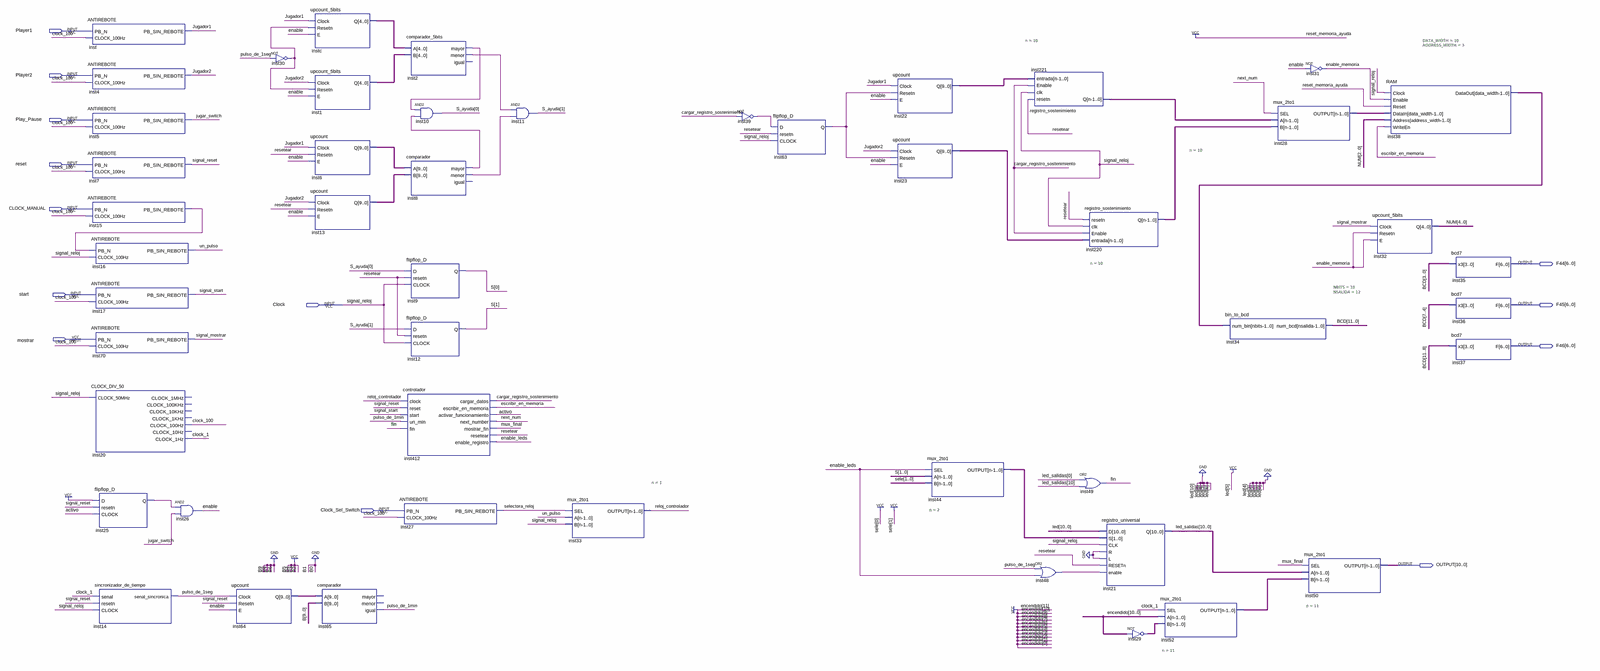
[diagram p0: schematic sheet, whole]
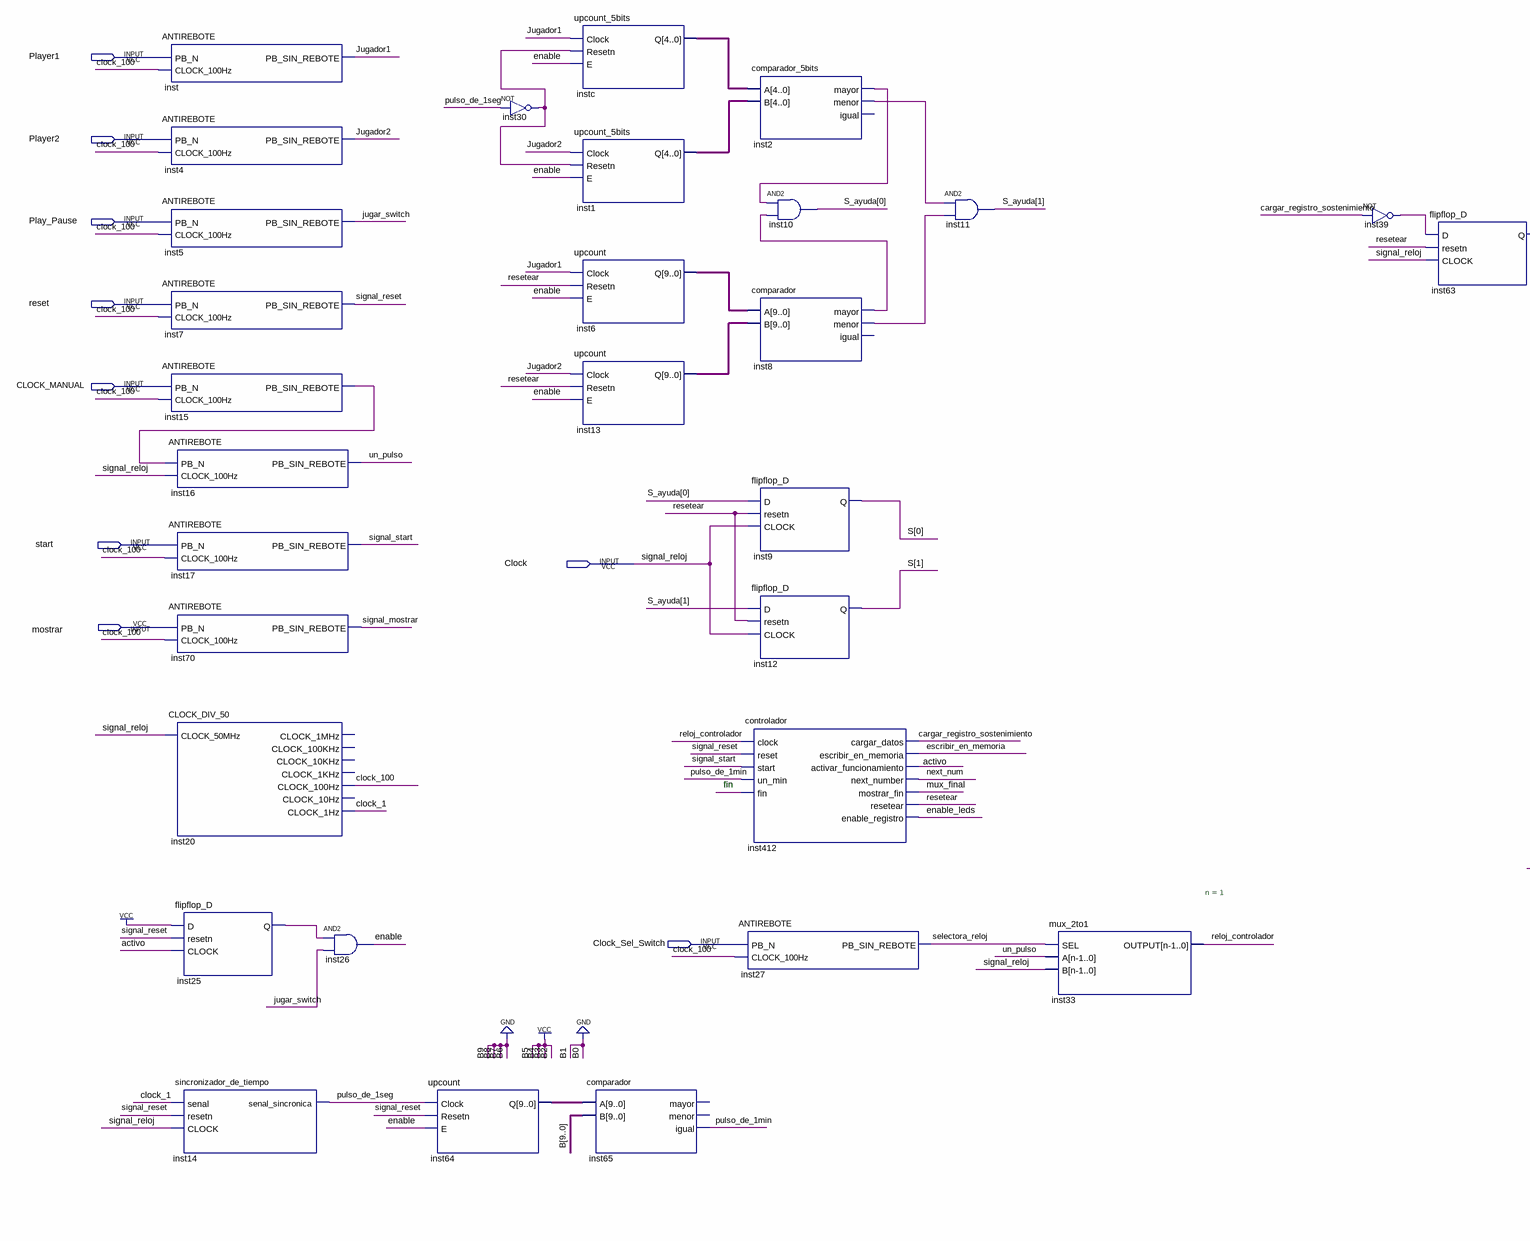
[diagram p1: schematic sheet, left part]
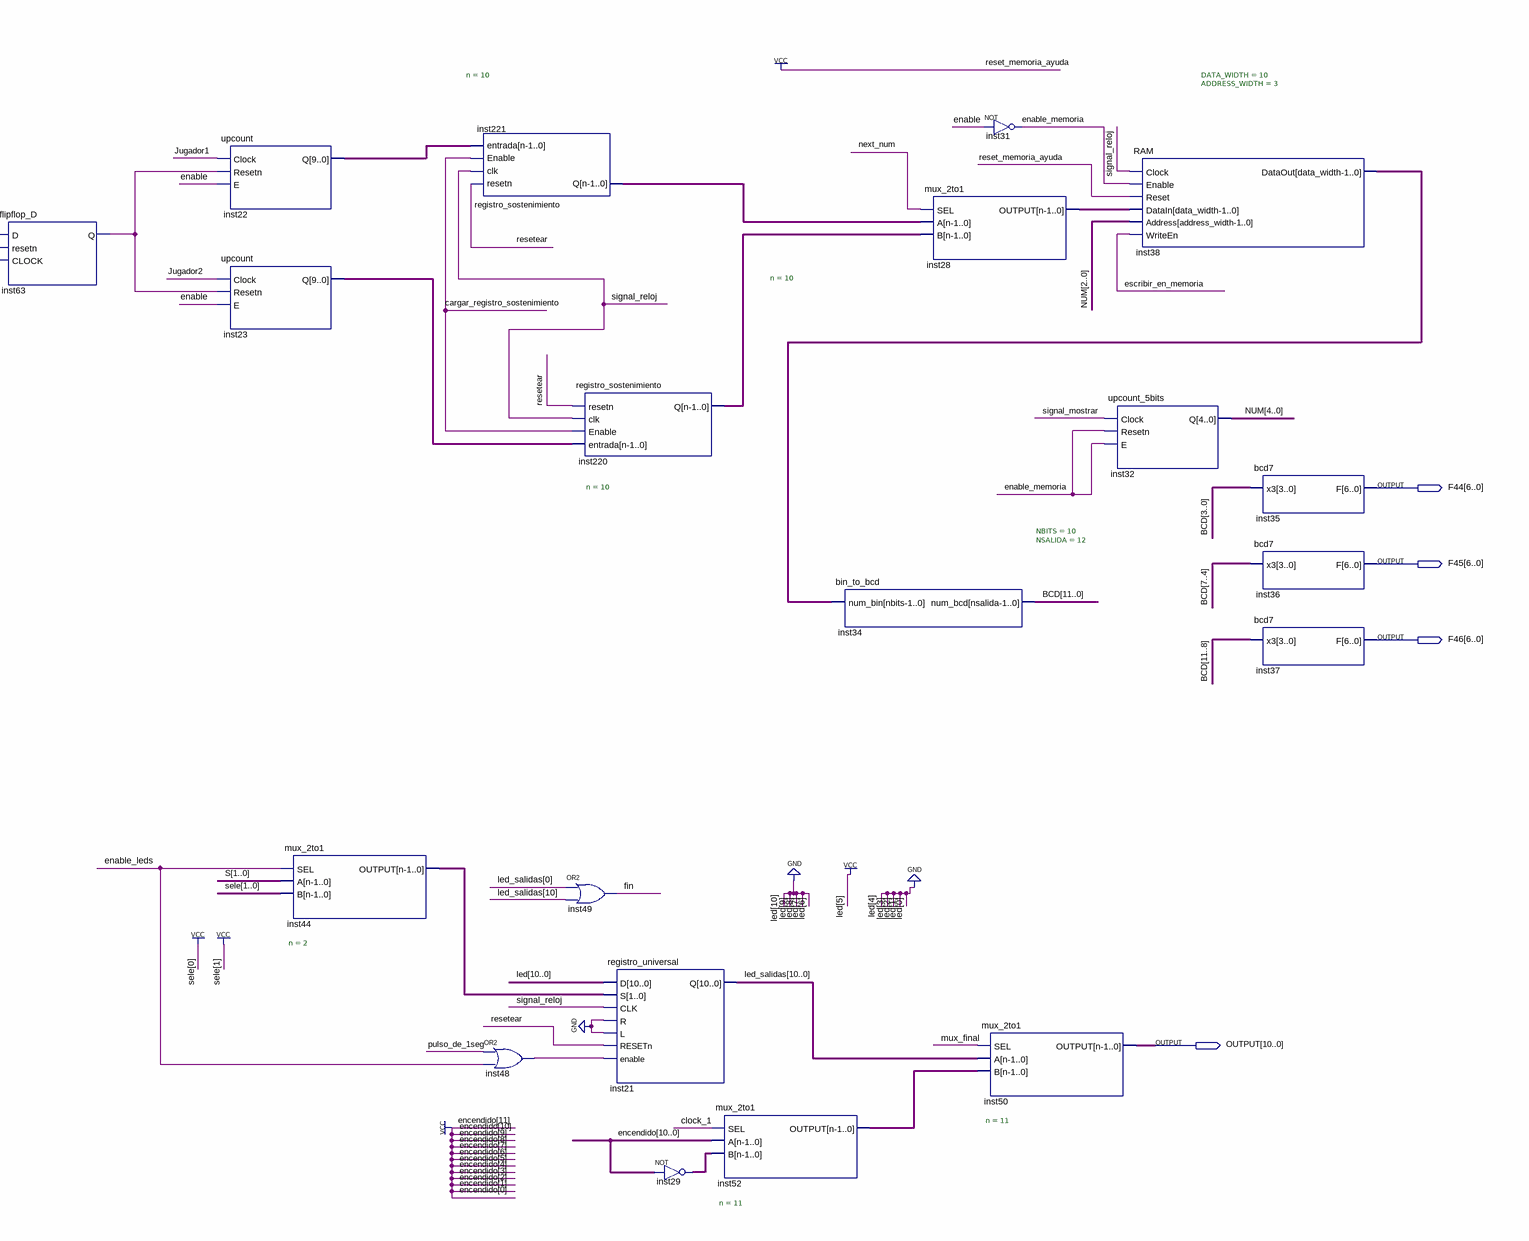
[diagram p2: schematic sheet, right part]
// Quartus schematic final.bdf as structural Verilog: 49 symbols, 13 pins
module \final  (
  input  Player1,
  input  Player2,
  input  Play_Pause,
  input  reset,
  input  CLOCK_MANUAL,
  input  start,
  input  Clock,
  input  mostrar,
  input  Clock_Sel_Switch,
  output [6:0] F44,
  output [6:0] F45,
  output [6:0] F46,
  output [10:0] OUTPUT
);

  wire activo, cargar_registro_sostenimiento, clock_1, clock_100, enable, enable_leds, enable_memoria,
       escribir_en_memoria, fin, inst2_mayor, inst2_menor, inst8_mayor, inst8_menor, inst15_pb_sin_rebote,
       inst25_q, inst30_out, inst39_out, inst48_out, inst63_q, Jugador1, Jugador2, jugar_switch, mux_final,
       next_num, pulso_de_1min, pulso_de_1seg, reloj_controlador, resetear, selectora_reloj, signal_mostrar,
       signal_reset, signal_start, un_pulso;
  wire [1:0] inst44_output, S, S_ayuda;
  wire [4:0] inst1_q, instc_q, NUM;
  wire [9:0] inst6_q, inst13_q, inst22_q, inst23_q, inst28_output, inst38_dataout, inst64_q, inst220_q,
       inst221_q;
  wire [10:0] inst29_out, inst52_output, led_salidas;
  wire [11:0] BCD;

  ANTIREBOTE inst (.PB_N(Player1), .CLOCK_100Hz(clock_100), .PB_SIN_REBOTE(Jugador1));
  ANTIREBOTE inst4 (.PB_N(Player2), .CLOCK_100Hz(clock_100), .PB_SIN_REBOTE(Jugador2));
  ANTIREBOTE inst5 (.PB_N(Play_Pause), .CLOCK_100Hz(clock_100), .PB_SIN_REBOTE(jugar_switch));
  ANTIREBOTE inst7 (.PB_N(reset), .CLOCK_100Hz(clock_100), .PB_SIN_REBOTE(signal_reset));
  ANTIREBOTE inst15 (.PB_N(CLOCK_MANUAL), .CLOCK_100Hz(clock_100), .PB_SIN_REBOTE(inst15_pb_sin_rebote));
  ANTIREBOTE inst16 (.PB_N(inst15_pb_sin_rebote), .CLOCK_100Hz(Clock), .PB_SIN_REBOTE(un_pulso));
  ANTIREBOTE inst17 (.PB_N(start), .CLOCK_100Hz(clock_100), .PB_SIN_REBOTE(signal_start));
  ANTIREBOTE inst70 (.PB_N(mostrar), .CLOCK_100Hz(clock_100), .PB_SIN_REBOTE(signal_mostrar));
  CLOCK_DIV_50 inst20 (
    .CLOCK_50MHz(Clock), .CLOCK_100Hz(clock_100), .CLOCK_1Hz(clock_1));  // open: CLOCK_1MHz, CLOCK_100KHz, CLOCK_10KHz, CLOCK_1KHz, CLOCK_10Hz
  flipflop_D inst25 (.D(1'b1), .resetn(signal_reset), .CLOCK(activo), .Q(inst25_q));
  sincronizador_de_tiempo inst14 (
    .senal(clock_1), .resetn(signal_reset), .CLOCK(Clock), .senal_sincronica(pulso_de_1seg));
  and inst26 (enable, inst25_q, jugar_switch);
  upcount inst64 (.Clock(pulso_de_1seg), .Resetn(signal_reset), .E(enable), .Q(inst64_q));
  not inst30 (inst30_out, pulso_de_1seg);
  upcount_5bits instc (.Clock(Jugador1), .Resetn(inst30_out), .E(enable), .Q(instc_q));
  upcount_5bits inst1 (.Clock(Jugador2), .Resetn(inst30_out), .E(enable), .Q(inst1_q));
  upcount inst6 (.Clock(Jugador1), .Resetn(resetear), .E(enable), .Q(inst6_q));
  upcount inst13 (.Clock(Jugador2), .Resetn(resetear), .E(enable), .Q(inst13_q));
  comparador inst65 (.A(inst64_q), .B(10'b0000111100), .igual(pulso_de_1min));  // open: mayor, menor
  comparador_5bits inst2 (.A(instc_q), .B(inst1_q), .mayor(inst2_mayor), .menor(inst2_menor));  // open: igual
  and inst10 (S_ayuda[0], inst2_mayor, inst8_mayor);
  comparador inst8 (.A(inst6_q), .B(inst13_q), .mayor(inst8_mayor), .menor(inst8_menor));  // open: igual
  flipflop_D inst9 (.D(S_ayuda[0]), .resetn(resetear), .CLOCK(Clock), .Q(S[0]));
  flipflop_D inst12 (.D(S_ayuda[1]), .resetn(resetear), .CLOCK(Clock), .Q(S[1]));
  controlador inst412 (
    .clock(reloj_controlador), .reset(signal_reset), .start(signal_start), .un_min(pulso_de_1min), .fin(fin),
    .cargar_datos(cargar_registro_sostenimiento), .escribir_en_memoria(escribir_en_memoria),
    .activar_funcionamiento(activo), .next_number(next_num), .mostrar_fin(mux_final), .resetear(resetear),
    .enable_registro(enable_leds));
  ANTIREBOTE inst27 (.PB_N(Clock_Sel_Switch), .CLOCK_100Hz(clock_100), .PB_SIN_REBOTE(selectora_reloj));
  and inst11 (S_ayuda[1], inst2_menor, inst8_menor);
  mux_2to1 #(.n(1)) inst33 (.SEL(selectora_reloj), .A(un_pulso), .B(Clock), .OUTPUT(reloj_controlador));
  not inst39 (inst39_out, cargar_registro_sostenimiento);
  flipflop_D inst63 (.D(inst39_out), .resetn(resetear), .CLOCK(Clock), .Q(inst63_q));
  upcount inst22 (.Clock(Jugador1), .Resetn(inst63_q), .E(enable), .Q(inst22_q));
  upcount inst23 (.Clock(Jugador2), .Resetn(inst63_q), .E(enable), .Q(inst23_q));
  mux_2to1 #(.n(2)) inst44 (.SEL(enable_leds), .A(S), .B(2'b11), .OUTPUT(inst44_output));
  registro_sostenimiento #(.n(10)) inst221 (
    .resetn(resetear), .clk(Clock), .Enable(cargar_registro_sostenimiento), .entrada(inst22_q), .Q(inst221_q));
  or inst48 (inst48_out, pulso_de_1seg, enable_leds);
  or inst49 (fin, led_salidas[0], led_salidas[10]);
  registro_sostenimiento #(.n(10)) inst220 (
    .resetn(resetear), .clk(Clock), .Enable(cargar_registro_sostenimiento), .entrada(inst23_q), .Q(inst220_q));
  registro_universal inst21 (
    .D(11'b00000100000), .S(inst44_output), .CLK(Clock), .R(1'b0), .L(1'b0), .RESETn(resetear),
    .enable(inst48_out), .Q(led_salidas));
  assign inst29_out = ~{11{1'b1}};  // NOT inst29, 11 bits wide
  mux_2to1 #(.n(11)) inst52 (.SEL(clock_1), .A({11{1'b1}}), .B(inst29_out), .OUTPUT(inst52_output));
  bin_to_bcd #(.NBITS(10), .NSALIDA(12)) inst34 (.num_bin(inst38_dataout), .num_bcd(BCD));
  mux_2to1 #(.n(10)) inst28 (.SEL(next_num), .A(inst221_q), .B(inst220_q), .OUTPUT(inst28_output));
  not inst31 (enable_memoria, enable);
  mux_2to1 #(.n(11)) inst50 (.SEL(mux_final), .A(led_salidas), .B(inst52_output), .OUTPUT(OUTPUT));
  upcount_5bits inst32 (.Clock(signal_mostrar), .Resetn(enable_memoria), .E(enable_memoria), .Q(NUM));
  RAM #(.DATA_WIDTH(10), .ADDRESS_WIDTH(3)) inst38 (
    .Clock(Clock), .Enable(enable_memoria), .Reset(1'b1), .DataIn(inst28_output), .Address(NUM[2:0]),
    .WriteEn(escribir_en_memoria), .DataOut(inst38_dataout));
  bcd7 inst35 (.x3(BCD[3:0]), .F(F44));
  bcd7 inst36 (.x3(BCD[7:4]), .F(F45));
  bcd7 inst37 (.x3(BCD[11:8]), .F(F46));

  // Other names for the same wires on the sheet: signal_reloj = Clock

  // Notes on the sheet:
  //   fin
endmodule
